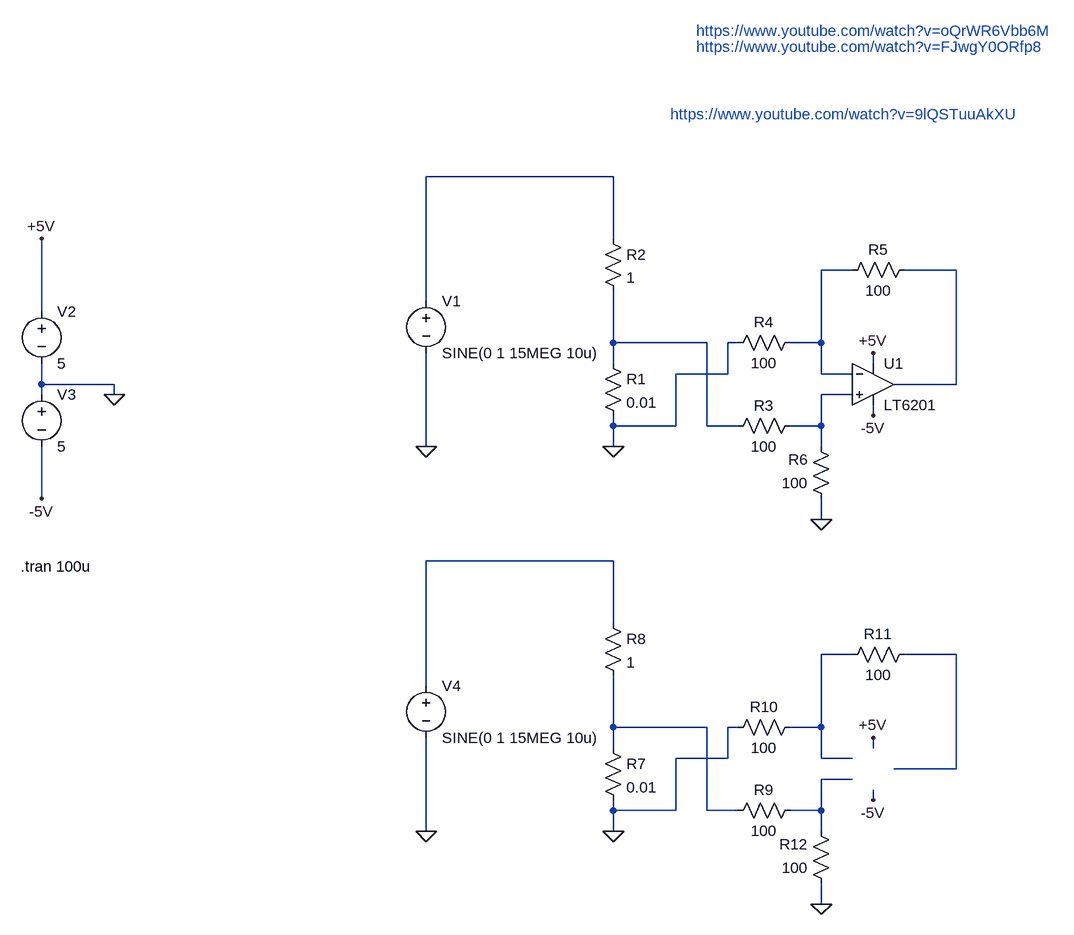
[diagram p0: schematic low_side_shunt_current_sensing_circuit.asc]
low_side_shunt_current_sensing_circuit.asc, the LTspice schematic file:
Version 4
SHEET 1 1192 996
WIRE 112 -144 -176 -144
WIRE 112 -48 112 -144
WIRE 480 0 432 0
WIRE 640 0 560 0
WIRE -176 48 -176 -144
WIRE -768 64 -768 -48
WIRE 112 112 112 32
WIRE 256 112 112 112
WIRE 304 112 288 112
WIRE 432 112 432 0
WIRE 432 112 384 112
WIRE 112 144 112 112
WIRE 512 144 512 128
WIRE 288 160 288 112
WIRE 288 160 208 160
WIRE 432 160 432 112
WIRE 480 160 432 160
WIRE -768 176 -768 144
WIRE -656 176 -768 176
WIRE 640 176 640 0
WIRE 640 176 544 176
WIRE -768 192 -768 176
WIRE -656 192 -656 176
WIRE 480 192 432 192
WIRE 512 224 512 208
WIRE 112 240 112 224
WIRE 208 240 208 160
WIRE 208 240 112 240
WIRE 256 240 256 112
WIRE 304 240 256 240
WIRE 432 240 432 192
WIRE 432 240 384 240
WIRE -176 272 -176 128
WIRE 112 272 112 240
WIRE 432 272 432 240
WIRE -768 352 -768 272
WIRE 432 384 432 352
WIRE 112 448 -176 448
WIRE 112 544 112 448
WIRE 480 592 432 592
WIRE 640 592 560 592
WIRE -176 640 -176 448
WIRE 112 704 112 624
WIRE 256 704 112 704
WIRE 304 704 288 704
WIRE 432 704 432 592
WIRE 432 704 384 704
WIRE 112 736 112 704
WIRE 512 736 512 720
WIRE 288 752 288 704
WIRE 288 752 208 752
WIRE 432 752 432 704
WIRE 480 752 432 752
WIRE 640 768 640 592
WIRE 640 768 544 768
WIRE 480 784 432 784
WIRE 512 816 512 800
WIRE 112 832 112 816
WIRE 208 832 208 752
WIRE 208 832 112 832
WIRE 256 832 256 704
WIRE 304 832 256 832
WIRE 432 832 432 784
WIRE 432 832 384 832
WIRE -176 864 -176 720
WIRE 112 864 112 832
WIRE 432 864 432 832
WIRE 432 976 432 944
FLAG 112 272 0
FLAG -176 272 0
FLAG 432 384 0
FLAG -656 192 0
FLAG -768 -48 +5V
FLAG -768 352 -5V
FLAG 512 128 +5V
FLAG 512 224 -5V
FLAG 112 864 0
FLAG -176 864 0
FLAG 432 976 0
FLAG 512 720 +5V
FLAG 512 816 -5V
SYMBOL res 96 128 R0
SYMATTR InstName R1
SYMATTR Value 0.01
SYMBOL res 96 -64 R0
SYMATTR InstName R2
SYMATTR Value 1
SYMBOL voltage -176 32 R0
WINDOW 123 0 0 Left 0
WINDOW 39 0 0 Left 0
SYMATTR InstName V1
SYMATTR Value SINE(0 1 15MEG 10u)
SYMBOL Opamps\\LT6201 512 176 R0
SYMATTR InstName U1
SYMBOL res 400 224 R90
WINDOW 0 0 56 VBottom 2
WINDOW 3 32 56 VTop 2
SYMATTR InstName R3
SYMATTR Value 100
SYMBOL res 400 96 R90
WINDOW 0 0 56 VBottom 2
WINDOW 3 32 56 VTop 2
SYMATTR InstName R4
SYMATTR Value 100
SYMBOL res 576 -16 R90
WINDOW 0 0 56 VBottom 2
WINDOW 3 32 56 VTop 2
SYMATTR InstName R5
SYMATTR Value 100
SYMBOL res 448 368 R180
WINDOW 0 36 76 Left 2
WINDOW 3 36 40 Left 2
SYMATTR InstName R6
SYMATTR Value 100
SYMBOL voltage -768 48 R0
WINDOW 123 0 0 Left 0
WINDOW 39 0 0 Left 0
SYMATTR InstName V2
SYMATTR Value 5
SYMBOL voltage -768 176 R0
WINDOW 123 0 0 Left 0
WINDOW 39 0 0 Left 0
SYMATTR InstName V3
SYMATTR Value 5
SYMBOL res 96 720 R0
SYMATTR InstName R7
SYMATTR Value 0.01
SYMBOL res 96 528 R0
SYMATTR InstName R8
SYMATTR Value 1
SYMBOL voltage -176 624 R0
WINDOW 123 0 0 Left 0
WINDOW 39 0 0 Left 0
SYMATTR InstName V4
SYMATTR Value SINE(0 1 15MEG 10u)
SYMBOL res 400 816 R90
WINDOW 0 0 56 VBottom 2
WINDOW 3 32 56 VTop 2
SYMATTR InstName R9
SYMATTR Value 100
SYMBOL res 400 688 R90
WINDOW 0 0 56 VBottom 2
WINDOW 3 32 56 VTop 2
SYMATTR InstName R10
SYMATTR Value 100
SYMBOL res 576 576 R90
WINDOW 0 0 56 VBottom 2
WINDOW 3 32 56 VTop 2
SYMATTR InstName R11
SYMATTR Value 100
SYMBOL res 448 960 R180
WINDOW 0 36 76 Left 2
WINDOW 3 36 40 Left 2
SYMATTR InstName R12
SYMATTR Value 100
TEXT -800 456 Left 2 !.tran 100u
TEXT 240 -368 Left 2 ;https://www.youtube.com/watch?v=oQrWR6Vbb6M
TEXT 200 -240 Left 2 ;https://www.youtube.com/watch?v=9lQSTuuAkXU
TEXT 240 -344 Left 2 ;https://www.youtube.com/watch?v=FJwgY0ORfp8

The netlist it stands for:
* low_side_shunt_current_sensing_circuit.asc
R1 N004 0 0.01
R2 N001 N004 1
V1 N001 0 SINE(0 1 15MEG 10u)
* U1: LT6201 (symbol Opamps\LT6201 not available, pins judged from their places): In+=N005 In-=N002 V+=+5V V-=-5V OUT=N003
R3 N005 N004 100
R4 N002 0 100
R5 N003 N002 100
R6 0 N005 100
V2 +5V 0 5
V3 0 -5V 5
R7 N009 0 0.01
R8 N006 N009 1
V4 N006 0 SINE(0 1 15MEG 10u)
R9 N010 N009 100
R10 N007 0 100
R11 N008 N007 100
R12 0 N010 100
.tran 100u
* https://www.youtube.com/watch?v=oQrWR6Vbb6M
* https://www.youtube.com/watch?v=9lQSTuuAkXU
* https://www.youtube.com/watch?v=FJwgY0ORfp8
.backanno
.end